# Altium schematic sheet 503398-18921_503398-1892.schdoc
size 127 x 99 mm
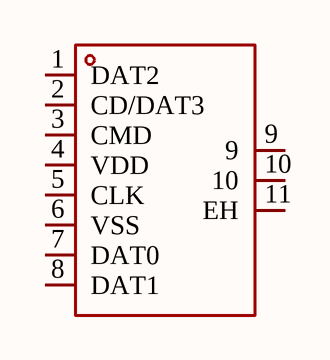
[diagram p0: 503398-18921_503398-1892.schdoc]

## Parts
CARD?  5033981892  [TF-SMD_503398-1892]  (value not drawn)

## Nets

Not connected (* = marked no-connect by the designer): CARD? 1(DAT2) 2(CD/DAT3) 3(CMD) 4(VDD) 5(CLK) 6(VSS) 7(DAT0) 8(DAT1) 9 10 11(EH)

## Library data of the parts
CARD? = 5033981892: Manufacturer: MOLEX; Symbol: 503398-1892; Add into BOM: yes; Card Connection Mode: Push-Push; Card Type: MicroSD Card (TF Card); Connector Type: Connector and Ejector; Device: 5033981892; LCSC Part Name: 自弹式 MicroSD卡(TF卡) 卡座; Supplier Part: C428492; Manufacturer Part: 5033981892; Supplier Footprint: SMD; JLCPCB Part Class: Extended Part; Datasheet: https://www.molex.com/content/dam/molex/molex-dot-com/products/automated/en-us/salesdrawingpdf/503/503398/5033981892_sd.pdf?inline\; Supplier: LCSC; Convert to PCB: yes; Additional Card Detection Pins: -; Supplementary Features: -; Height Above Board: 1.28mm; Operating Temperature: -25℃~+85℃